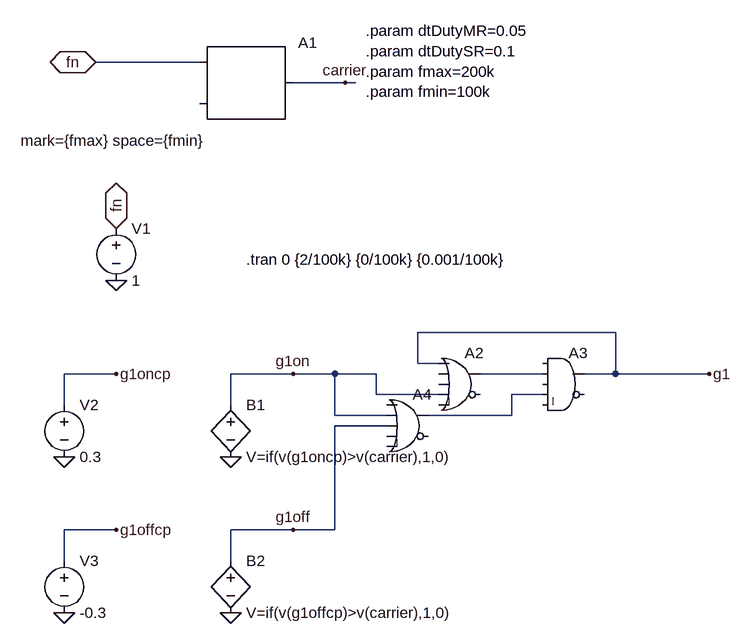
[diagram p0: schematic userLib_PFMtemp1.asc]
userLib_PFMtemp1.asc, the LTspice schematic file:
Version 4.1
SHEET 1 1648 924
WIRE 192 -112 32 -112
WIRE 416 -80 336 -80
WIRE 432 -80 416 -80
WIRE 832 304 528 304
WIRE 528 352 528 304
WIRE 560 352 528 352
WIRE 64 368 -16 368
WIRE 336 368 240 368
WIRE 400 368 336 368
WIRE 464 368 400 368
WIRE 720 368 624 368
WIRE 832 368 832 304
WIRE 832 368 784 368
WIRE 976 368 832 368
WIRE 464 400 464 368
WIRE 560 400 464 400
WIRE 720 400 672 400
WIRE -16 416 -16 368
WIRE 240 416 240 368
WIRE 400 432 400 368
WIRE 480 432 400 432
WIRE 672 432 672 400
WIRE 672 432 544 432
WIRE 480 448 400 448
WIRE 64 608 -16 608
WIRE 336 608 240 608
WIRE 400 608 400 448
WIRE 400 608 336 608
WIRE -16 656 -16 608
WIRE 240 656 240 608
FLAG 32 -112 fn
IOPIN 32 -112 BiDir
FLAG 64 224 0
FLAG 64 144 fn
IOPIN 64 144 BiDir
FLAG 416 -80 carrier
FLAG -16 496 0
FLAG 64 368 g1oncp
FLAG 240 496 0
FLAG 336 368 g1on
FLAG -16 736 0
FLAG 64 608 g1offcp
FLAG 240 736 0
FLAG 336 608 g1off
FLAG 976 368 g1
SYMBOL SpecialFunctions\\modulate 192 -112 R0
WINDOW 3 -275 121 Left 2
SYMATTR Value mark={fmax} space={fmin}
SYMATTR InstName A1
SYMBOL voltage 64 128 R0
SYMATTR InstName V1
SYMATTR Value 1
SYMBOL voltage -16 400 R0
SYMATTR InstName V2
SYMATTR Value 0.3
SYMBOL bv 240 400 R0
SYMATTR InstName B1
SYMATTR Value V=if(v(g1oncp)>v(carrier),1,0)
SYMBOL voltage -16 640 R0
SYMATTR InstName V3
SYMATTR Value -0.3
SYMBOL bv 240 640 R0
SYMATTR InstName B2
SYMATTR Value V=if(v(g1offcp)>v(carrier),1,0)
SYMBOL Digital\\or 592 320 R0
SYMATTR InstName A2
SYMBOL Digital\\and 752 320 R0
SYMATTR InstName A3
SYMBOL Digital\\or 512 384 R0
SYMATTR InstName A4
TEXT 448 -160 Left 2 !.param dtDutyMR=0.05\n.param dtDutySR=0.1\n.param fmax=200k\n.param fmin=100k
TEXT 264 192 Left 2 !.tran 0 {2/100k} {0/100k} {0.001/100k}

The netlist it stands for:
* userLib_PFMtemp1.asc
A1 fn 0 0 0 0 0 carrier 0 MODULATOR mark={fmax} space={fmin}
V1 fn 0 1
V2 g1oncp 0 0.3
B1 g1on 0 V=if(v(g1oncp)>v(carrier),1,0)
V3 g1offcp 0 -0.3
B2 g1off 0 V=if(v(g1offcp)>v(carrier),1,0)
A2 g1 0 0 g1on 0 0 N001 0 OR
A3 0 N001 0 N002 0 0 g1 0 AND
A4 0 g1on g1off 0 0 0 N002 0 OR
.param dtDutyMR=0.05
.param dtDutySR=0.1
.param fmax=200k
.param fmin=100k
.tran 0 {2/100k} {0/100k} {0.001/100k}
.backanno
.end